# Altium schematic sheet Root.SchDoc
size A4; SheetNumber: 1; SheetTotal: 3
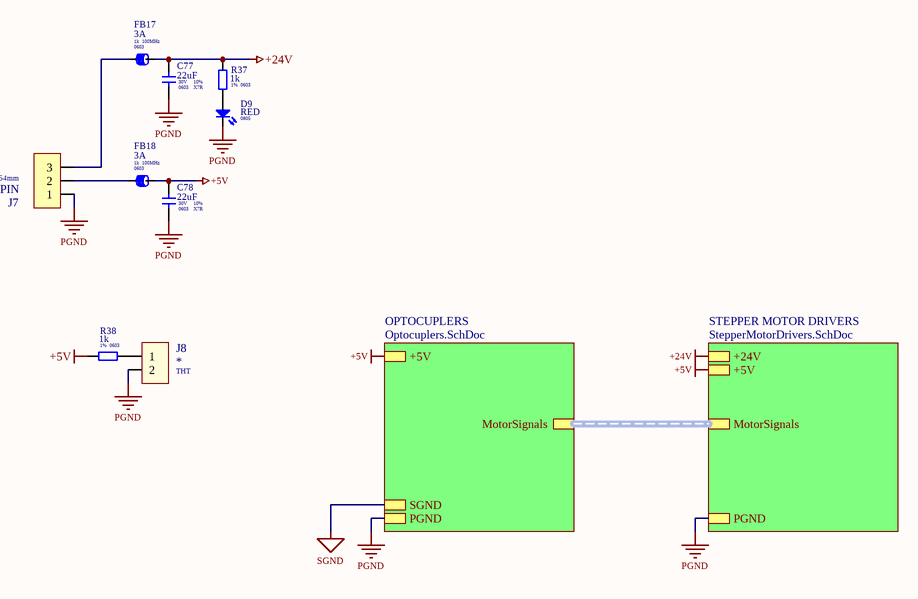
[diagram p0: Root.SchDoc]

## Parts
C77  value 22uF  DielectricType: X7R  Voltage: 30V  Tolerant: 10%  Package: 0603  [CAPC1608X06L]  (hidden comment: 22uF/30V)
C78  value 22uF  DielectricType: X7R  Voltage: 30V  Tolerant: 10%  Package: 0603  [CAPC1608X06L]  (hidden comment: 22uF/30V)
D9  Package: 0805  [DIOMELF1608L]  (hidden comment: RED)
FB17  Min Frequency: 100MHz  Impedance: 1k  Package: 0603  [INDC1608X06N]  (hidden comment: 3A)
FB18  Min Frequency: 100MHz  Impedance: 1k  Package: 0603  [INDC1608X06L]  (hidden comment: 3A)
J7  Package: 2.54mm  [B3B-PH-K-S]  (hidden comment: 3PIN)
J8  Package: THT  [B2B-PH-K-S]  (hidden comment: *)
R37  value 1k  Package: 0603  Tolerance: 1%  [RESC1608X06L]  (hidden comment: 1k 1%)
R38  value 1k  Package: 0603  Tolerance: 1%  [RESC1608X06L]  (hidden comment: 1k 1%)

## Sub-sheets
OPTOCUPLERS = Optocuplers.SchDoc: MotorSignals (harness MotorDriverSignals), +5V, PGND, SGND
STEPPER MOTOR DRIVERS = StepperMotorDrivers.SchDoc: +5V, PGND, +24V, MotorSignals (harness MotorDriverSignals)

## Nets
+5V: C78.2 FB18.2 R38.2 ; sheet STEPPER MOTOR DRIVERS/+5V, sheet OPTOCUPLERS/+5V
+24V: C77.2 FB17.2 R37.2 ; sheet STEPPER MOTOR DRIVERS/+24V
PGND: C77.1 C78.1 D9.2(K) J7.1 J8.2 ; sheet STEPPER MOTOR DRIVERS/PGND, sheet OPTOCUPLERS/PGND
SGND: sheet OPTOCUPLERS/SGND
NetD9_1: D9.1(A) R37.1
NetFB17_1: FB17.1 J7.3
NetFB18_1: FB18.1 J7.2
NetJ8_1: J8.1 R38.1

## Buses and harness runs
harness sheet OPTOCUPLERS/MotorSignals = sheet STEPPER MOTOR DRIVERS/MotorSignals

## Notes on the sheet
- Title:
- Size:
- Sheet:
- Revision:
- A4
- of
- SCHEMATIC DIAGRAM
- Variant:
- DrawnBy:
- CheckedBy:
- www.destechnology.pl <http://www.destechnology.pl>
- Date:
- File:

## Library data of the parts
C77 C78 = C: Supplier Part Number 1: *
D9 = D_LED: pin to pad: 1>2 2>1; manufacture: *; helpurl: *; Supplier Part Number 1: *; value: RED
FB17 FB18 = FB_1: Ferrite bead - 2-nd Symbol; manufacture: *; helpurl: *; Supplier Part Number 1: *; value: 3A
J7 = CON_3PIN: WORKPLAN_Code: EP00; value: 3PIN
J8 = CON_2PIN: WORKPLAN_Code: EP00; manufacture: *; helpurl: *; value: *
R37 R38 = R: Supplier Part Number 1: *